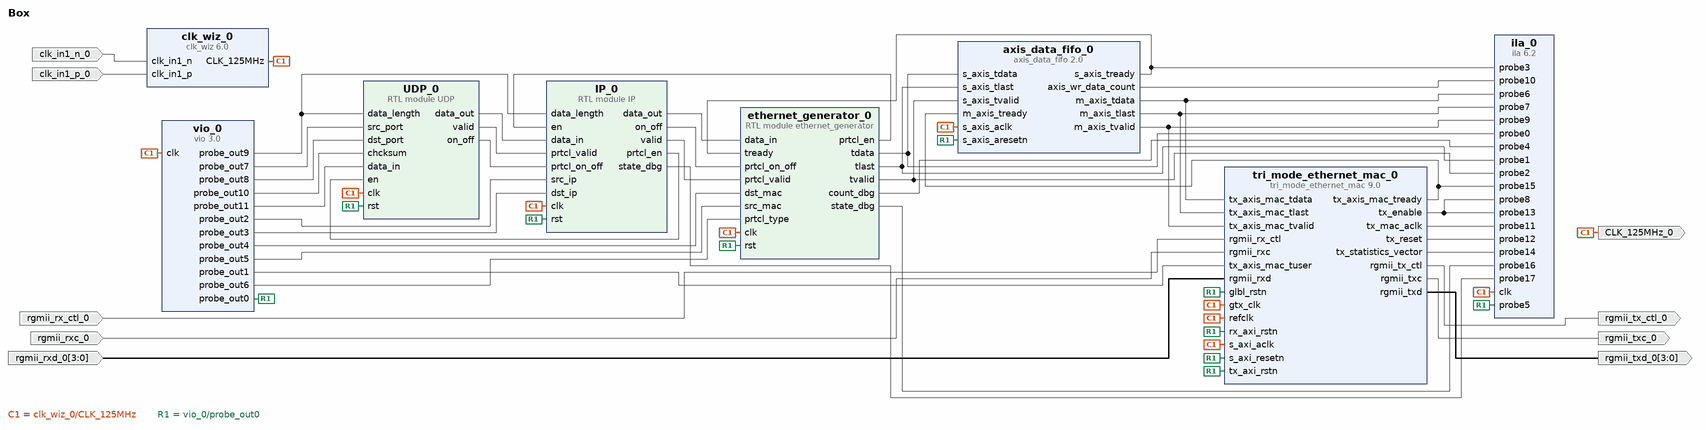
[diagram p0: block diagram of the top level]
# Vivado block design Box, xc7z015clg485-1, Vivado 2019.1
create_bd_design Box

create_bd_port -dir O -type clk CLK_125MHz_0
set_property -dict {CONFIG.FREQ_HZ 125000000} [get_bd_ports CLK_125MHz_0]
create_bd_port -dir I -type clk clk_in1_n_0
create_bd_port -dir I -type clk clk_in1_p_0
create_bd_port -dir I rgmii_rx_ctl_0
create_bd_port -dir I -type clk rgmii_rxc_0
create_bd_port -dir I -from 3 -to 0 rgmii_rxd_0
create_bd_port -dir O rgmii_tx_ctl_0
create_bd_port -dir O -type clk rgmii_txc_0
create_bd_port -dir O -from 3 -to 0 rgmii_txd_0

create_bd_cell -type ip -vlnv xilinx.com:ip:axis_data_fifo:2.0 axis_data_fifo_0
set_property -dict {CONFIG.HAS_TLAST 1 CONFIG.HAS_WR_DATA_COUNT 1} [get_bd_cells axis_data_fifo_0]
create_bd_cell -type ip -vlnv xilinx.com:ip:clk_wiz:6.0 clk_wiz_0
set_property -dict [list \
  CONFIG.CLKIN1_JITTER_PS 64.0 \
  CONFIG.CLKOUT1_JITTER 186.558 \
  CONFIG.CLKOUT1_PHASE_ERROR 204.239 \
  CONFIG.CLKOUT1_REQUESTED_OUT_FREQ 125 \
  CONFIG.CLKOUT2_JITTER 194.337 \
  CONFIG.CLKOUT2_PHASE_ERROR 204.239 \
  CONFIG.CLKOUT2_USED true \
  CONFIG.CLK_OUT1_PORT CLK_125MHz \
  CONFIG.CLK_OUT2_PORT CLK_100MHz \
  CONFIG.MMCM_CLKFBOUT_MULT_F 32.000 \
  CONFIG.MMCM_CLKIN1_PERIOD 6.400 \
  CONFIG.MMCM_CLKOUT0_DIVIDE_F 8.000 \
  CONFIG.MMCM_CLKOUT1_DIVIDE 10 \
  CONFIG.MMCM_DIVCLK_DIVIDE 5 \
  CONFIG.NUM_OUT_CLKS 2 \
  CONFIG.PRIM_IN_FREQ 156.25 \
  CONFIG.PRIM_SOURCE Differential_clock_capable_pin \
] [get_bd_cells clk_wiz_0]
create_bd_cell -type ip -vlnv xilinx.com:ip:ila:6.2 ila_0
set_property -dict [list \
  CONFIG.C_ENABLE_ILA_AXI_MON false \
  CONFIG.C_MONITOR_TYPE Native \
  CONFIG.C_NUM_OF_PROBES 18 \
  CONFIG.C_PROBE0_WIDTH 8 \
  CONFIG.C_PROBE10_WIDTH 32 \
  CONFIG.C_PROBE11_WIDTH 1 \
  CONFIG.C_PROBE14_WIDTH 32 \
  CONFIG.C_PROBE16_WIDTH 4 \
  CONFIG.C_PROBE17_WIDTH 5 \
  CONFIG.C_PROBE4_WIDTH 6 \
  CONFIG.C_PROBE6_WIDTH 8 \
] [get_bd_cells ila_0]
create_bd_cell -type ip -vlnv xilinx.com:ip:tri_mode_ethernet_mac:9.0 tri_mode_ethernet_mac_0
set_property -dict [list \
  CONFIG.Management_Frequency 125.00 \
  CONFIG.Physical_Interface RGMII \
  CONFIG.SupportLevel 1 \
] [get_bd_cells tri_mode_ethernet_mac_0]
create_bd_cell -type ip -vlnv xilinx.com:ip:vio:3.0 vio_0
set_property -dict [list \
  CONFIG.C_NUM_PROBE_IN 0 \
  CONFIG.C_NUM_PROBE_OUT 12 \
  CONFIG.C_PROBE_OUT10_INIT_VAL 0x0000 \
  CONFIG.C_PROBE_OUT10_WIDTH 16 \
  CONFIG.C_PROBE_OUT11_INIT_VAL 0x48656C6C6F20576F726C64000000000000000000 \
  CONFIG.C_PROBE_OUT11_WIDTH 160 \
  CONFIG.C_PROBE_OUT2_INIT_VAL 0xC0A80109 \
  CONFIG.C_PROBE_OUT2_WIDTH 32 \
  CONFIG.C_PROBE_OUT3_INIT_VAL 0xC0A80102 \
  CONFIG.C_PROBE_OUT3_WIDTH 32 \
  CONFIG.C_PROBE_OUT4_INIT_VAL 0xFFFFFFFFFFFF \
  CONFIG.C_PROBE_OUT4_WIDTH 48 \
  CONFIG.C_PROBE_OUT5_INIT_VAL 0x000A35000001 \
  CONFIG.C_PROBE_OUT5_WIDTH 48 \
  CONFIG.C_PROBE_OUT6_INIT_VAL 0x0800 \
  CONFIG.C_PROBE_OUT6_WIDTH 16 \
  CONFIG.C_PROBE_OUT7_INIT_VAL 0x0044 \
  CONFIG.C_PROBE_OUT7_WIDTH 16 \
  CONFIG.C_PROBE_OUT8_INIT_VAL 0x0043 \
  CONFIG.C_PROBE_OUT8_WIDTH 16 \
  CONFIG.C_PROBE_OUT9_INIT_VAL 0x000C \
  CONFIG.C_PROBE_OUT9_WIDTH 16 \
] [get_bd_cells vio_0]
create_bd_cell -type module -reference ethernet_generator ethernet_generator_0
create_bd_cell -type module -reference IP IP_0
create_bd_cell -type module -reference UDP UDP_0

# ---- connections ----

connect_bd_net -net IP_0_busIP [get_bd_pins IP_0/data_out] [get_bd_pins ethernet_generator_0/data_in]
connect_bd_net -net IP_0_start [get_bd_pins IP_0/on_off] [get_bd_pins ethernet_generator_0/prtcl_on_off]
connect_bd_net [get_bd_pins axis_data_fifo_0/axis_wr_data_count] [get_bd_pins ila_0/probe10]
connect_bd_net [get_bd_pins axis_data_fifo_0/m_axis_tdata] [get_bd_pins ila_0/probe6] [get_bd_pins tri_mode_ethernet_mac_0/tx_axis_mac_tdata]
connect_bd_net [get_bd_pins axis_data_fifo_0/m_axis_tlast] [get_bd_pins ila_0/probe7] [get_bd_pins tri_mode_ethernet_mac_0/tx_axis_mac_tlast]
connect_bd_net [get_bd_pins axis_data_fifo_0/m_axis_tvalid] [get_bd_pins ila_0/probe9] [get_bd_pins tri_mode_ethernet_mac_0/tx_axis_mac_tvalid]
connect_bd_net [get_bd_pins axis_data_fifo_0/s_axis_tready] [get_bd_pins ila_0/probe3] [get_bd_pins ethernet_generator_0/tready]
connect_bd_net -net clk_in1_n_0_1 [get_bd_ports clk_in1_n_0] [get_bd_pins clk_wiz_0/clk_in1_n]
connect_bd_net -net clk_in1_p_0_1 [get_bd_ports clk_in1_p_0] [get_bd_pins clk_wiz_0/clk_in1_p]
connect_bd_net [get_bd_pins clk_wiz_0/CLK_125MHz] \
  [get_bd_ports CLK_125MHz_0] [get_bd_pins axis_data_fifo_0/s_axis_aclk] [get_bd_pins ila_0/clk] \
  [get_bd_pins tri_mode_ethernet_mac_0/gtx_clk] [get_bd_pins tri_mode_ethernet_mac_0/refclk] \
  [get_bd_pins tri_mode_ethernet_mac_0/s_axi_aclk] [get_bd_pins vio_0/clk] [get_bd_pins ethernet_generator_0/clk] \
  [get_bd_pins IP_0/clk] [get_bd_pins UDP_0/clk]
connect_bd_net -net ethernet_generator_0_count [get_bd_pins ethernet_generator_0/count_dbg] [get_bd_pins ila_0/probe4]
connect_bd_net -net ethernet_generator_0_enIP [get_bd_pins ethernet_generator_0/prtcl_en] [get_bd_pins IP_0/en]
connect_bd_net [get_bd_pins ethernet_generator_0/tdata] [get_bd_pins axis_data_fifo_0/s_axis_tdata] [get_bd_pins ila_0/probe0]
connect_bd_net [get_bd_pins ethernet_generator_0/tlast] [get_bd_pins axis_data_fifo_0/s_axis_tlast] [get_bd_pins ila_0/probe1]
connect_bd_net [get_bd_pins ethernet_generator_0/tvalid] [get_bd_pins axis_data_fifo_0/s_axis_tvalid] [get_bd_pins ila_0/probe2]
connect_bd_net -net rgmii_rx_ctl_0_1 [get_bd_ports rgmii_rx_ctl_0] [get_bd_pins tri_mode_ethernet_mac_0/rgmii_rx_ctl]
connect_bd_net -net rgmii_rxc_0_1 [get_bd_ports rgmii_rxc_0] [get_bd_pins tri_mode_ethernet_mac_0/rgmii_rxc]
connect_bd_net -net rgmii_rxd_0_1 [get_bd_ports rgmii_rxd_0] [get_bd_pins tri_mode_ethernet_mac_0/rgmii_rxd]
connect_bd_net [get_bd_pins tri_mode_ethernet_mac_0/rgmii_tx_ctl] [get_bd_ports rgmii_tx_ctl_0]
connect_bd_net [get_bd_pins tri_mode_ethernet_mac_0/rgmii_txc] [get_bd_ports rgmii_txc_0]
connect_bd_net [get_bd_pins tri_mode_ethernet_mac_0/rgmii_txd] [get_bd_ports rgmii_txd_0]
connect_bd_net [get_bd_pins tri_mode_ethernet_mac_0/tx_axis_mac_tready] [get_bd_pins axis_data_fifo_0/m_axis_tready] [get_bd_pins ila_0/probe15]
connect_bd_net [get_bd_pins tri_mode_ethernet_mac_0/tx_enable] [get_bd_pins ila_0/probe8] [get_bd_pins ila_0/probe13]
connect_bd_net [get_bd_pins tri_mode_ethernet_mac_0/tx_mac_aclk] [get_bd_pins ila_0/probe11]
connect_bd_net [get_bd_pins tri_mode_ethernet_mac_0/tx_reset] [get_bd_pins ila_0/probe12]
connect_bd_net [get_bd_pins tri_mode_ethernet_mac_0/tx_statistics_vector] [get_bd_pins ila_0/probe14]
connect_bd_net [get_bd_pins vio_0/probe_out0] \
  [get_bd_pins axis_data_fifo_0/s_axis_aresetn] [get_bd_pins ila_0/probe5] [get_bd_pins tri_mode_ethernet_mac_0/glbl_rstn] \
  [get_bd_pins tri_mode_ethernet_mac_0/rx_axi_rstn] [get_bd_pins tri_mode_ethernet_mac_0/s_axi_resetn] \
  [get_bd_pins tri_mode_ethernet_mac_0/tx_axi_rstn] [get_bd_pins ethernet_generator_0/rst] [get_bd_pins IP_0/rst] \
  [get_bd_pins UDP_0/rst]
connect_bd_net [get_bd_pins vio_0/probe_out1] [get_bd_pins tri_mode_ethernet_mac_0/tx_axis_mac_tuser]
connect_bd_net [get_bd_pins vio_0/probe_out2] [get_bd_pins IP_0/src_ip]
connect_bd_net [get_bd_pins vio_0/probe_out3] [get_bd_pins IP_0/dst_ip]
connect_bd_net [get_bd_pins vio_0/probe_out4] [get_bd_pins ethernet_generator_0/dst_mac]
connect_bd_net [get_bd_pins vio_0/probe_out5] [get_bd_pins ethernet_generator_0/src_mac]
connect_bd_net [get_bd_pins vio_0/probe_out6] [get_bd_pins ethernet_generator_0/prtcl_type]
connect_bd_net [get_bd_pins IP_0/valid] [get_bd_pins ethernet_generator_0/prtcl_valid]
connect_bd_net [get_bd_pins ethernet_generator_0/state_dbg] [get_bd_pins ila_0/probe16]
connect_bd_net [get_bd_pins IP_0/state_dbg] [get_bd_pins ila_0/probe17]
connect_bd_net [get_bd_pins IP_0/prtcl_en] [get_bd_pins UDP_0/en]
connect_bd_net [get_bd_pins UDP_0/data_out] [get_bd_pins IP_0/data_in]
connect_bd_net [get_bd_pins UDP_0/valid] [get_bd_pins IP_0/prtcl_valid]
connect_bd_net [get_bd_pins UDP_0/on_off] [get_bd_pins IP_0/prtcl_on_off]
connect_bd_net [get_bd_pins vio_0/probe_out7] [get_bd_pins UDP_0/src_port]
connect_bd_net [get_bd_pins vio_0/probe_out8] [get_bd_pins UDP_0/dst_port]
connect_bd_net [get_bd_pins vio_0/probe_out9] [get_bd_pins IP_0/data_length] [get_bd_pins UDP_0/data_length]
connect_bd_net [get_bd_pins vio_0/probe_out10] [get_bd_pins UDP_0/chcksum]
connect_bd_net [get_bd_pins vio_0/probe_out11] [get_bd_pins UDP_0/data_in]

validate_bd_design
save_bd_design
